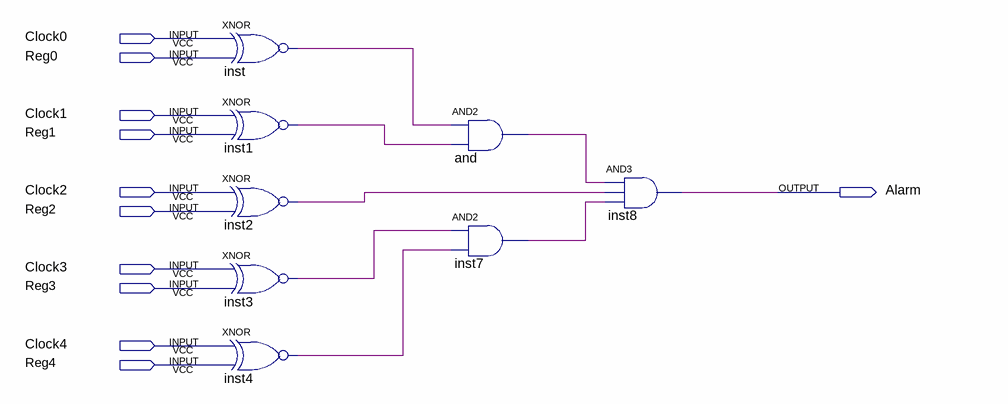
[diagram p0: schematic sheet]
// Quartus schematic alarm.bdf as structural Verilog: 8 symbols, 11 pins
module alarm (
  input  Clock0,
  input  Reg0,
  input  Clock1,
  input  Reg1,
  input  Clock2,
  input  Reg2,
  input  Clock3,
  input  Reg3,
  input  Clock4,
  input  Reg4,
  output Alarm
);

  wire and_out, inst1_out, inst2_out, inst3_out, inst4_out, inst7_out, inst_out;

  xnor inst (inst_out, Clock0, Reg0);
  xnor inst1 (inst1_out, Clock1, Reg1);
  xnor inst2 (inst2_out, Clock2, Reg2);
  xnor inst3 (inst3_out, Clock3, Reg3);
  xnor inst4 (inst4_out, Clock4, Reg4);
  and \and  (and_out, inst_out, inst1_out);
  and inst7 (inst7_out, inst3_out, inst4_out);
  and inst8 (Alarm, and_out, inst2_out, inst7_out);
endmodule
